# EAGLE design TinyCube13_FourLayer (EAGLE 7.5.0)

## Sheet 1 of 2
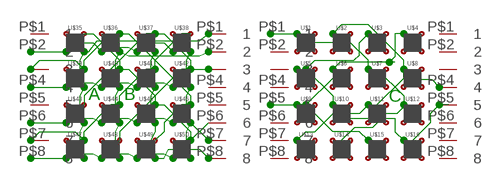
[diagram p0: schematic, sheet 1]

### Parts
JP1  TINY_HEADER_DEV  [TINY_HEADER_PKG]
JP2  TINY_HEADER_DEV  [TINY_HEADER_PKG]
U$1  PILLAR  [10MIL]
U$2  PILLAR  [10MIL]
U$3  PILLAR  [10MIL]
U$4  PILLAR  [10MIL]
U$5  PILLAR  [10MIL]
U$6  PILLAR  [10MIL]
U$7  PILLAR  [10MIL]
U$8  PILLAR  [10MIL]
U$9  PILLAR  [10MIL]
U$10  PILLAR  [10MIL]
U$11  PILLAR  [10MIL]
U$12  PILLAR  [10MIL]
U$13  PILLAR  [10MIL]
U$14  PILLAR  [10MIL]
U$15  PILLAR  [10MIL]
U$16  PILLAR  [10MIL]
U$35  PILLAR  [10MIL]
U$36  PILLAR  [10MIL]
U$37  PILLAR  [10MIL]
U$38  PILLAR  [10MIL]
U$39  PILLAR  [10MIL]
U$40  PILLAR  [10MIL]
U$41  PILLAR  [10MIL]
U$42  PILLAR  [10MIL]
U$43  PILLAR  [10MIL]
U$44  PILLAR  [10MIL]
U$45  PILLAR  [10MIL]
U$46  PILLAR  [10MIL]
U$47  PILLAR  [10MIL]
U$48  PILLAR  [10MIL]
U$49  PILLAR  [10MIL]
U$50  PILLAR  [10MIL]
U$51  TINY_HEADER_DEV  [TINY_HEADER_PKG]
U$52  TINY_HEADER_DEV  [TINY_HEADER_PKG]

### Nets
N$2: JP2.P$4 U$2.R(B) U$8.R(B) U$11.R(B) U$13.R(B)
N$3: JP1.P$1 U$1.R(B) U$7.R(B) U$12.R(B) U$14.R(B)
N$4: JP2.P$5 U$3.R(B) U$5.R(B) U$10.R(B) U$16.R(B)
N$5: JP1.P$5 U$4.R(B) U$6.R(B) U$9.R(B) U$15.R(B)
N$7: U$35.+(G) U$40.+(G) U$45.+(G) U$50.+(G) U$52.P$6
N$9: U$35.G(A) U$36.G(A) U$37.G(A) U$38.G(A) U$51.P$2
N$10: U$39.G(A) U$40.G(A) U$41.G(A) U$42.G(A) U$51.P$4
N$11: U$43.G(A) U$44.G(A) U$45.G(A) U$46.G(A) U$51.P$6
N$12: U$47.G(A) U$48.G(A) U$49.G(A) U$50.G(A) U$51.P$8
N$13: U$35.B(R) U$39.B(R) U$43.B(R) U$47.B(R) U$52.P$1
N$15: U$37.B(R) U$41.B(R) U$45.B(R) U$49.B(R) U$52.P$8
N$16: U$38.B(R) U$42.B(R) U$46.B(R) U$50.B(R) U$52.P$7
N$17: U$36.B(R) U$40.B(R) U$44.B(R) U$48.B(R) U$52.P$2
N$18: U$36.+(G) U$39.+(G) U$46.+(G) U$49.+(G) U$51.P$3
N$19: U$37.+(G) U$42.+(G) U$43.+(G) U$48.+(G) U$52.P$3
N$21: U$38.+(G) U$41.+(G) U$44.+(G) U$47.+(G) U$51.P$7
Unconnected: JP1.P$2 JP1.P$3 JP1.P$4 JP1.P$6 JP1.P$7 JP1.P$8 JP2.P$1 JP2.P$2 JP2.P$3 JP2.P$6 JP2.P$7 JP2.P$8 U$1.+(G) U$1.B(R) U$1.G(A) U$2.+(G) U$2.B(R) U$2.G(A) U$3.+(G) U$3.B(R) U$3.G(A) U$4.+(G) U$4.B(R) U$4.G(A) U$5.+(G) U$5.B(R) U$5.G(A) U$6.+(G) U$6.B(R) U$6.G(A) U$7.+(G) U$7.B(R) U$7.G(A) U$8.+(G) U$8.B(R) U$8.G(A) U$9.+(G) U$9.B(R) U$9.G(A) U$10.+(G) U$10.B(R) U$10.G(A) U$11.+(G) U$11.B(R) U$11.G(A) U$12.+(G) U$12.B(R) U$12.G(A) U$13.+(G) U$13.B(R) U$13.G(A) U$14.+(G) U$14.B(R) U$14.G(A) U$15.+(G) U$15.B(R) U$15.G(A) U$16.+(G) U$16.B(R) U$16.G(A) U$35.R(B) U$36.R(B) U$37.R(B) U$38.R(B) U$39.R(B) U$40.R(B) U$41.R(B) U$42.R(B) U$43.R(B) U$44.R(B) U$45.R(B) U$46.R(B) U$47.R(B) U$48.R(B) U$49.R(B) U$50.R(B) U$51.P$1 U$51.P$5 U$52.P$4 U$52.P$5

### Notes on the sheet
- A | B | C

## Sheet 2 of 2

## Library data of the parts
JP1 JP2 U$51 U$52 = TinyHeader:TINY_HEADER_DEV
U$1-U$16 U$35-U$50 = PILLAR:PILLAR

## Board
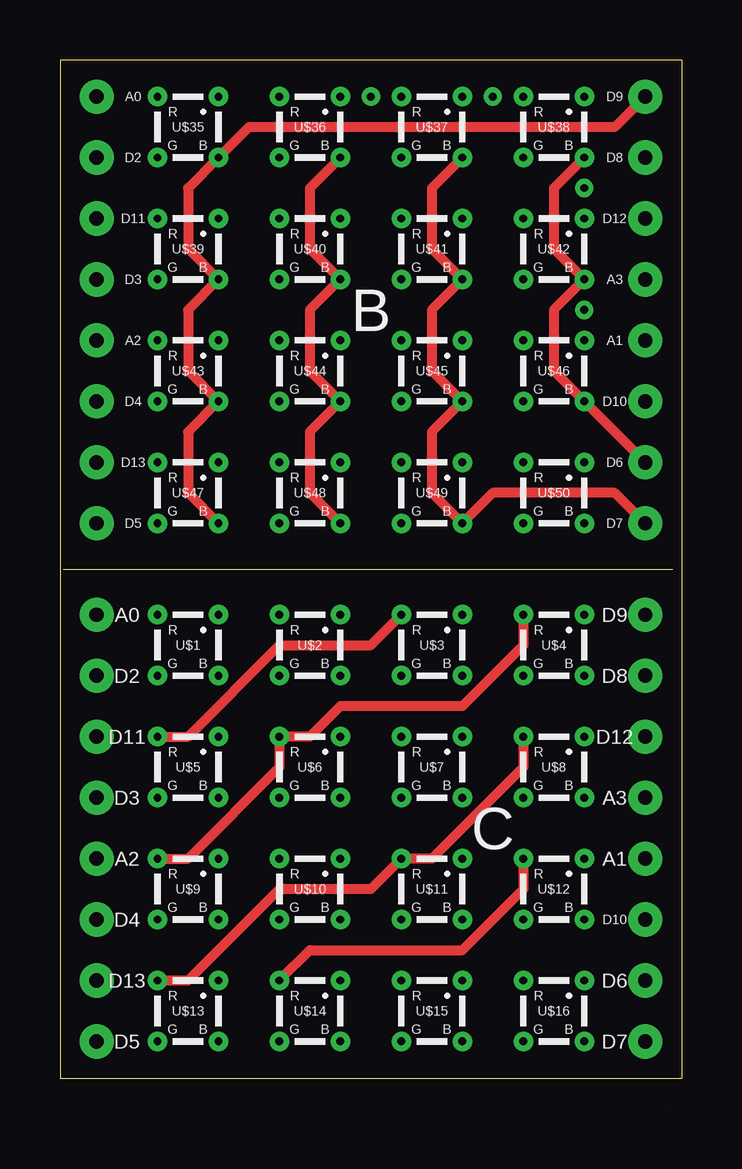
[diagram p1: board, top side]
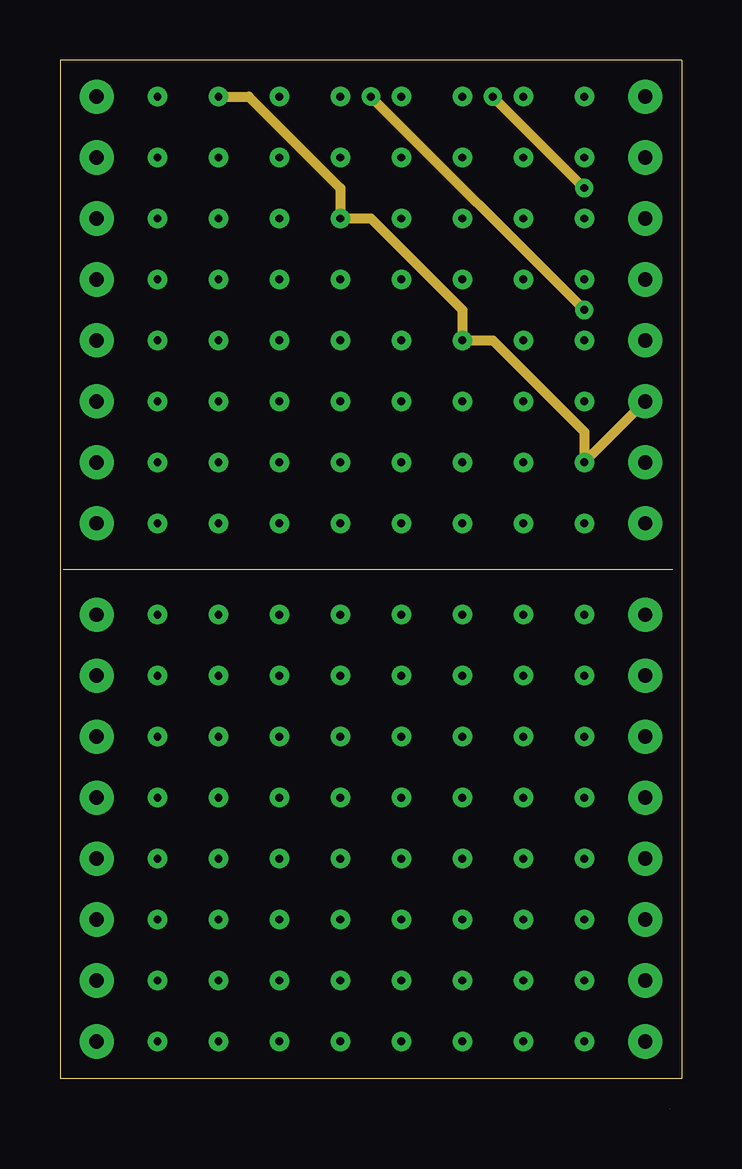
[diagram p2: board, inner layer Route2]
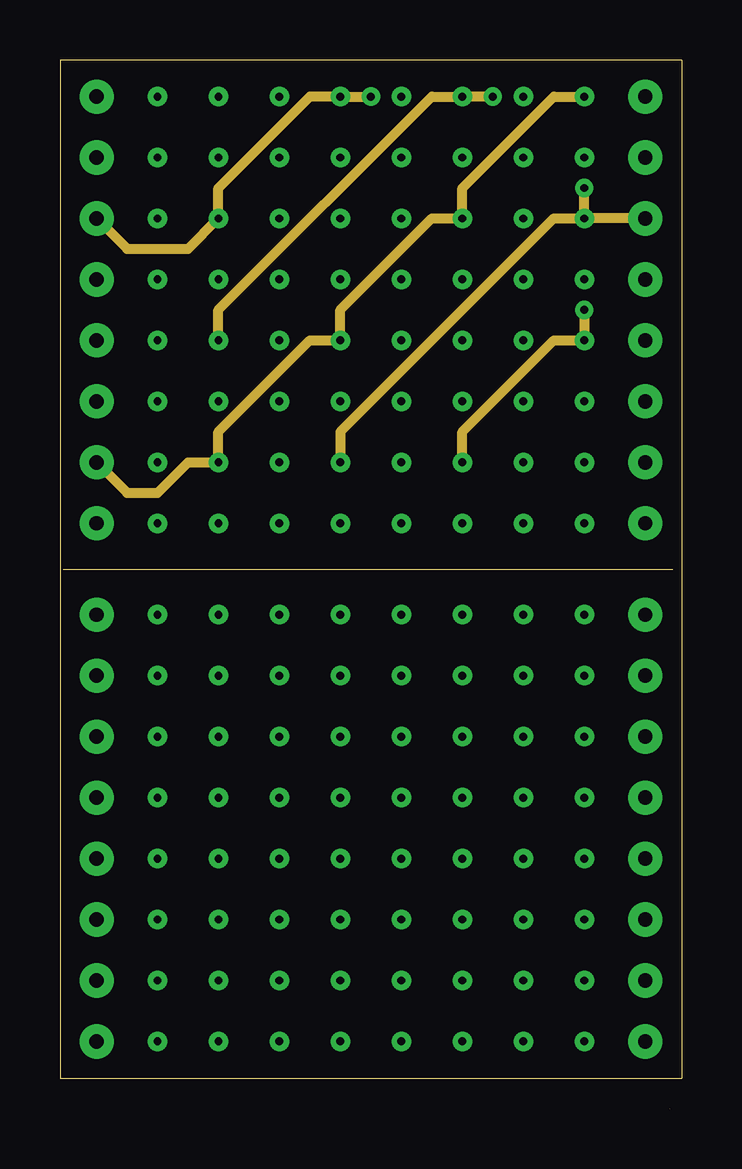
[diagram p3: board, inner layer Route15]
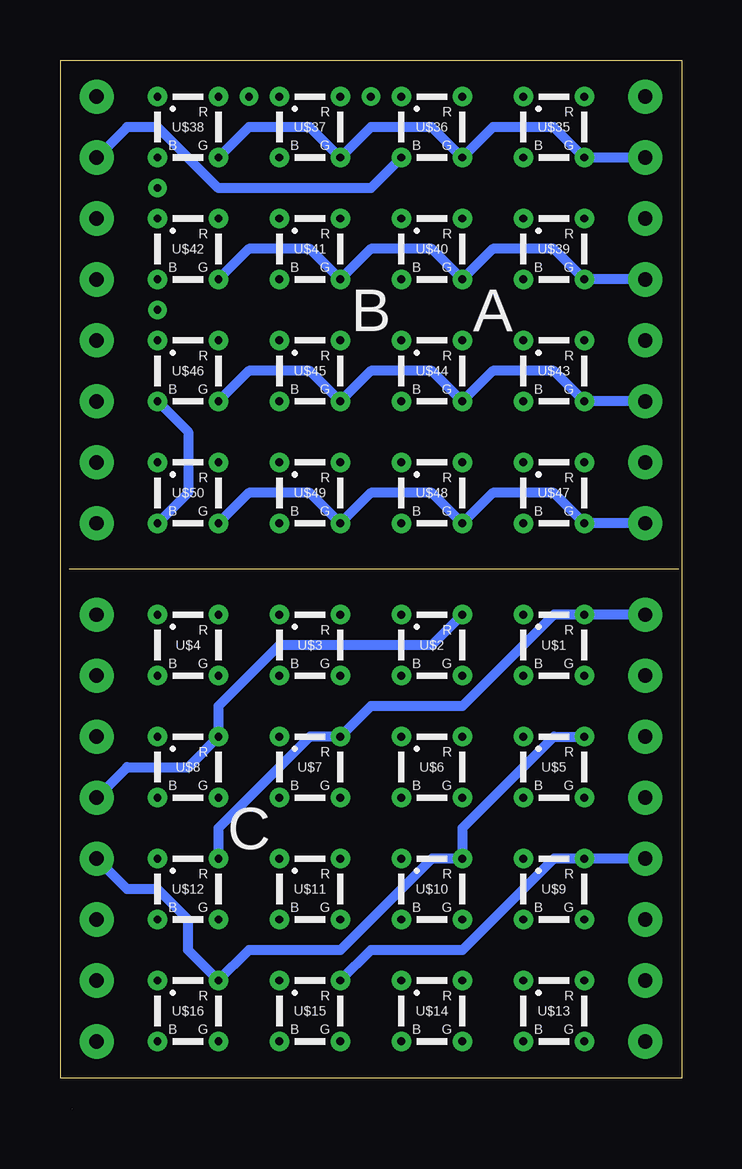
[diagram p4: board, bottom side, seen from below]

Size 25.91 x 43.69 mm. Coordinates in mm from the lower left corner, seen from the top.
Outline: 0.13,22.48 25.53,22.48
Outline: 25.4,0 25.4,0
Outline: 25.91,43.69 25.91,1.27 0,1.27 0,43.69 25.91,43.69
Copper layers ((1*2)+(15*16)): Top 0.035559375mm / dielectric 0.17018125mm / Route2 0.01778125mm / dielectric 47mil / Route15 0.01778125mm / dielectric 0.17018125mm / Bottom 0.035559375mm
Design rules "OSHPark-4layer *": minimum track width 5mil, minimum drill 10mil, track to track 5mil, track to pad 5mil, pad to pad 5mil, via to via 5mil, smd to smd 5mil, copper to edge 15mil, drill to drill 6mil, minimum pad ring 4mil, minimum via ring 4mil, stop-mask expansion 2.5mil, vias tented up to drill 0mil, thermal gap 10mil

### Footprints (pad centres in the part's own frame; a part is rotated, then mirrored left to right if it is on the bottom)
TINY_HEADER_PKG = drill 0.6 pad 1.422: P$1 0,0; P$2 0,-2.54; P$3 0,-5.08; P$4 0,-7.62; P$5 0,-10.16; P$6 0,-12.7; P$7 0,-15.24; P$8 0,-17.78
10MIL = drill 0.33 pad 0.813: + 1.27,1.27; B 1.27,-1.27; G -1.27,-1.27; R -1.27,1.27

### Placement (x,y rotation side)
JP1  1.52,20.57 0 top
JP2  24.38,20.57 0 top
U$1  5.33,19.3 0 top
U$2  10.41,19.3 0 top
U$3  15.49,19.3 0 top
U$4  20.57,19.3 0 top
U$5  5.33,14.22 0 top
U$6  10.41,14.22 0 top
U$7  15.49,14.22 0 top
U$8  20.57,14.22 0 top
U$9  5.33,9.14 0 top
U$10  10.41,9.14 0 top
U$11  15.49,9.14 0 top
U$12  20.57,9.14 0 top
U$13  5.33,4.06 0 top
U$14  10.41,4.06 0 top
U$15  15.49,4.06 0 top
U$16  20.57,4.06 0 top
U$35  5.33,40.89 0 top
U$36  10.41,40.89 0 top
U$37  15.49,40.89 0 top
U$38  20.57,40.89 0 top
U$39  5.33,35.81 0 top
U$40  10.41,35.81 0 top
U$41  15.49,35.81 0 top
U$42  20.57,35.81 0 top
U$43  5.33,30.73 0 top
U$44  10.41,30.73 0 top
U$45  15.49,30.73 0 top
U$46  20.57,30.73 0 top
U$47  5.33,25.65 0 top
U$48  10.41,25.65 0 top
U$49  15.49,25.65 0 top
U$50  20.57,25.65 0 top
U$51  1.52,42.16 0 top
U$52  24.38,42.16 0 top

### Tracks (layer width: path | path; a pad name or v marks a point on that pad's centre or on a via)
N$2
  Top 0.406: U$8.R 19.3,14.22 15.49,10.41 U$11.R 12.95,9.14 9.14,9.14 5.33,5.33 U$13.R
  Bottom 0.406: U$2.R 10.41,19.3 16.76,19.3 19.3,16.76 U$8.R 20.57,14.22 23.11,14.22 JP2.P$4
N$3
  Top 0.406: U$12.R 19.3,9.14 16.76,6.6 10.41,6.6 U$14.R
  Bottom 0.406: JP1.P$1 U$1.R 5.33,20.57 9.14,16.76 12.95,16.76 U$7.R 15.49,15.49 19.3,11.68 U$12.R
N$4
  Top 0.406: U$5.R 5.33,15.49 9.14,19.3 12.95,19.3 U$3.R
  Bottom 0.406: U$5.R 5.33,15.49 9.14,11.68 U$10.R 10.41,10.41 14.22,6.6 18.03,6.6 U$16.R 20.57,6.6 20.57,7.87 21.84,9.14 23.11,9.14 JP2.P$5
N$5
  Top 0.406: U$9.R 5.33,10.41 9.14,14.22 U$6.R 10.41,15.49 11.68,16.76 16.76,16.76 19.3,19.3 U$4.R
  Bottom 0.406: U$15.R 12.95,6.6 9.14,6.6 5.33,10.41 U$9.R JP1.P$5
N$7
  Route2 0.406: U$35.+ 7.87,42.16 11.68,38.35 U$40.+ 12.95,37.08 16.76,33.27 U$45.+ 18.03,32 21.84,28.19 U$50.+ U$52.P$6
N$9
  Bottom 0.406: U$51.P$2 U$35.G 5.33,40.89 7.87,40.89 U$36.G 10.41,40.89 12.95,40.89 U$37.G 15.49,40.89 18.03,40.89 U$38.G
N$10
  Bottom 0.406: U$51.P$4 U$39.G 5.33,35.81 7.87,35.81 U$40.G 10.41,35.81 12.95,35.81 U$41.G 15.49,35.81 18.03,35.81 U$42.G
N$11
  Bottom 0.406: U$51.P$6 U$43.G 5.33,30.73 7.87,30.73 U$44.G 10.41,30.73 12.95,30.73 U$45.G 15.49,30.73 18.03,30.73 U$46.G
N$12
  Bottom 0.406: U$51.P$8 U$47.G 5.33,25.65 7.87,25.65 U$48.G 10.41,25.65 12.95,25.65 U$49.G 15.49,25.65 18.03,25.65 U$50.G
N$13
  Top 0.406: U$52.P$1 23.11,40.89 7.87,40.89 U$35.B 5.33,38.35 5.33,35.81 U$39.B 5.33,33.27 5.33,30.73 U$43.B 5.33,28.19 5.33,25.65 U$47.B
N$15
  Top 0.406: U$37.B 15.49,38.35 15.49,35.81 U$41.B 15.49,33.27 15.49,30.73 U$45.B 15.49,28.19 15.49,25.65 U$49.B 18.03,25.65 23.11,25.65 U$52.P$8
N$16
  Top 0.406: U$38.B 20.57,38.35 20.57,35.81 U$42.B 20.57,33.27 20.57,30.73 U$46.B U$52.P$7
  Bottom 0.406: U$46.B 20.57,28.19 20.57,25.65 U$50.B
N$17
  Top 0.406: U$36.B 10.41,38.35 10.41,35.81 U$40.B 10.41,33.27 10.41,30.73 U$44.B 10.41,28.19 10.41,25.65 U$48.B
  Bottom 0.406: U$36.B 12.95,38.35 19.3,38.35 21.84,40.89 23.11,40.89 U$52.P$2
N$18  (via drill 0.33 pad 0.76)
  Route2 0.406: v12.95,42.16 v21.84,33.27
  Route15 0.406: U$51.P$3 2.79,35.81 5.33,35.81 U$39.+ 6.6,38.35 10.41,42.16 U$36.+ v12.95,42.16 | v21.84,33.27 U$46.+ 20.57,32 16.76,28.19 U$49.+
N$19  (via drill 0.33 pad 0.76)
  Route2 0.406: v18.03,42.16 v21.84,38.35
  Route15 0.406: U$52.P$3 U$42.+ | U$48.+ 11.68,28.19 20.57,37.08 U$42.+ | U$42.+ v21.84,38.35 | v18.03,42.16 U$37.+ 15.49,42.16 6.6,33.27 U$43.+
N$21
  Route15 0.406: U$51.P$7 2.79,25.65 4.06,25.65 5.33,26.92 U$47.+ 6.6,28.19 10.41,32 U$44.+ 11.68,33.27 15.49,37.08 U$41.+ 16.76,38.35 20.57,42.16 U$38.+

### Text on the board
bPlace: A | B | C
tNames: A0 | D9 | D2 | D8 | D11 | D12 | D3 | A3 | B | A2 | A1 | D4 | D10 | D13 | D6 | D5 | D7 | A0 | D9 | D2 | D8 | D11 | D12 | D3 | A3 | C | A2 | A1 | D4 | D10 | D13 | D6 | D5 | D7